# EAGLE schematic POR_LICZ-eagle (EAGLE 6.5.0)
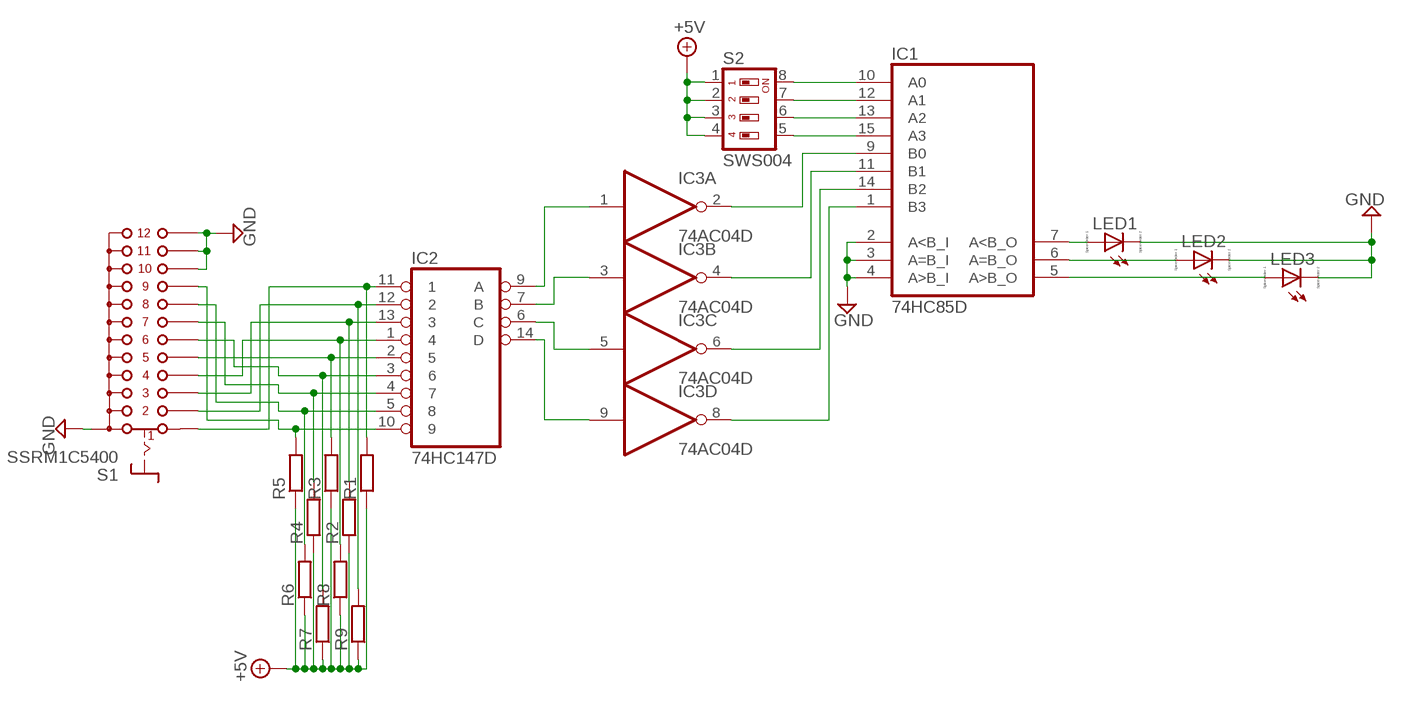
[diagram p0: schematic, sheet 1]

## Parts
IC1  74HC85D  [SO16]
IC2  74HC147D  [SO16]
IC3  74AC04D  [SO14]
LED1  LED_E  [LED_1206]
LED2  LED_E  [LED_1206]
LED3  LED_E  [LED_1206]
R1  R-EU_0204/2V  [0204V]
R2  R-EU_0204/2V  [0204V]
R3  R-EU_0204/2V  [0204V]
R4  R-EU_0204/2V  [0204V]
R5  R-EU_0204/2V  [0204V]
R6  R-EU_0204/2V  [0204V]
R7  R-EU_0204/2V  [0204V]
R8  R-EU_0204/2V  [0204V]
R9  R-EU_0204/2V  [0204V]
S1  SSRM1C5400  [SRRM1C5400]
S2  SWS004  [SMS-004]

## Nets
+5V: R1.1 R2.1 R3.1 R4.1 R5.1 R6.1 R7.1 R8.1 R9.1 S2.1 S2.2 S2.3 S2.4
GND: IC1.2(A<B_I) IC1.3(A=B_I) IC1.4(A>B_I) LED1.C LED2.C LED3.C S1.10 S1.11 S1.12 S1.13(A)
N$1: IC2.11 R1.2 S1.1
N$2: IC2.12 R9.2 S1.2
N$3: IC2.13 R2.2 S1.3
N$4: IC2.1 R8.2 S1.4
N$5: IC2.2 R3.2 S1.5
N$6: IC2.3 R7.2 S1.6
N$7: IC2.4 R4.2 S1.7
N$8: IC2.5 R6.2 S1.8
N$9: IC2.10 R5.2 S1.9
N$10: IC2.9(A) IC3.1(A:I)
N$11: IC2.7(B) IC3.3(B:I)
N$12: IC2.6(C) IC3.5(C:I)
N$13: IC2.14(D) IC3.9(D:I)
N$14: IC1.1(B3) IC3.8(D:O)
N$15: IC1.14(B2) IC3.6(C:O)
N$16: IC1.11(B1) IC3.4(B:O)
N$17: IC1.9(B0) IC3.2(A:O)
N$18: IC1.15(A3) S2.5
N$19: IC1.13(A2) S2.6
N$20: IC1.12(A1) S2.7
N$21: IC1.10(A0) S2.8
N$22: IC1.7(A<B_O) LED1.A
N$23: IC1.6(A=B_O) LED2.A
N$24: IC1.5(A>B_O) LED3.A
Unconnected: IC3.10(E:O) IC3.11(E:I) IC3.12(F:O) IC3.13(F:I)

## Power pins joined to a net without a drawn wire
GND: IC1.8(GND) IC2.8(GND) IC3.7(P:GND)
VCC: IC1.16(VCC) IC2.16(VCC) IC3.14(P:VCC)

## Library data of the parts
IC1 = 74xx-eu:74*85: 4-bit magnitude COMPARATOR
IC2 = 74xx-eu:74*147: 10-line to 4-line and 8-line to 3-line PRIORITY DECODER
IC3 = 74xx-eu:74*04: Hex INVERTER
LED1-LED3 = eagle-ltspice:LED_E: LED Source: http://www.osram.convergy.de Source: www.luxeon.com Source: www.kingbright.com; SPICEMODEL: NONE; SPICEPREFIX: D; SPICETYPE: diode
R1-R9 = rcl:R-EU_: RESISTOR, European symbol
S1 = switch:SSRM1: 12-position General-purpose Vertical Type Rotary Switch 1 Pole 12 Positions Source: ALPS - SRRM.pdf
S2 = smd-special:SWS004: SMD Dip Switch 4 pol.